# EAGLE schematic pdp8 (EAGLE 6.6.0)
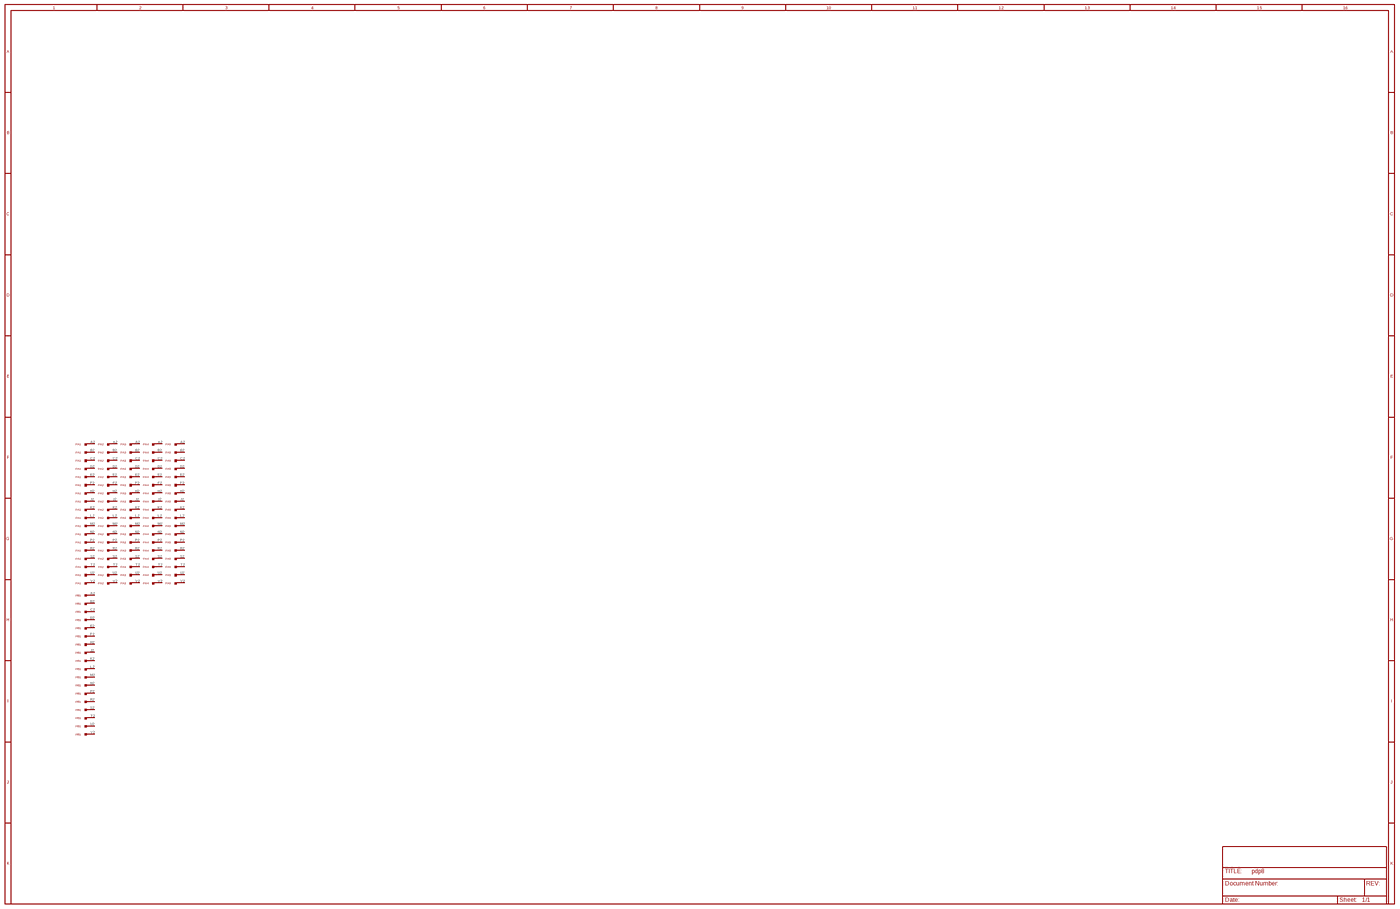
[diagram p0: schematic, sheet 1, overview]
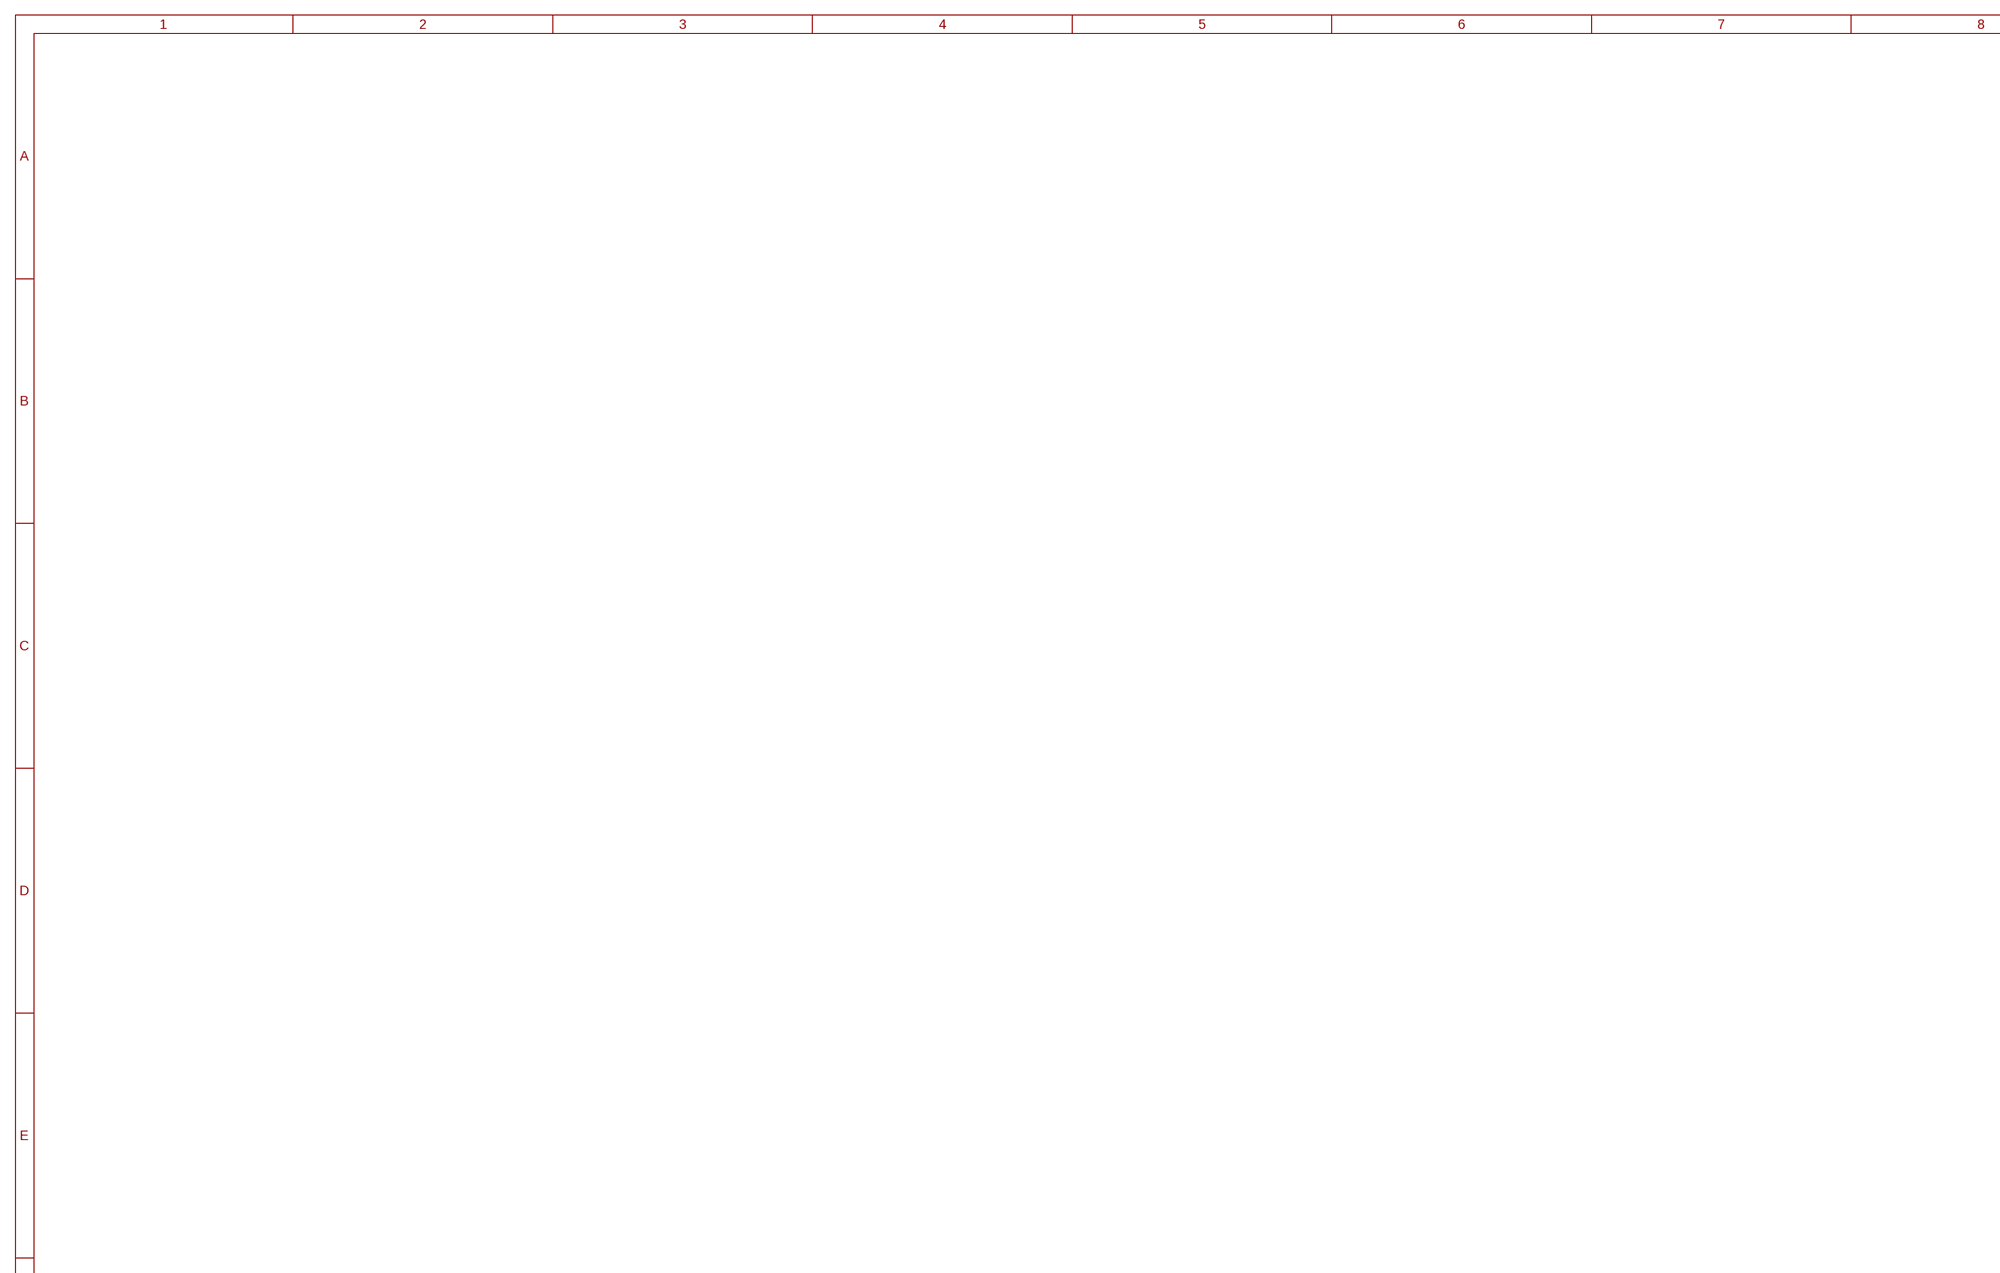
[diagram p1: schematic, sheet 1, part 1 of 4]
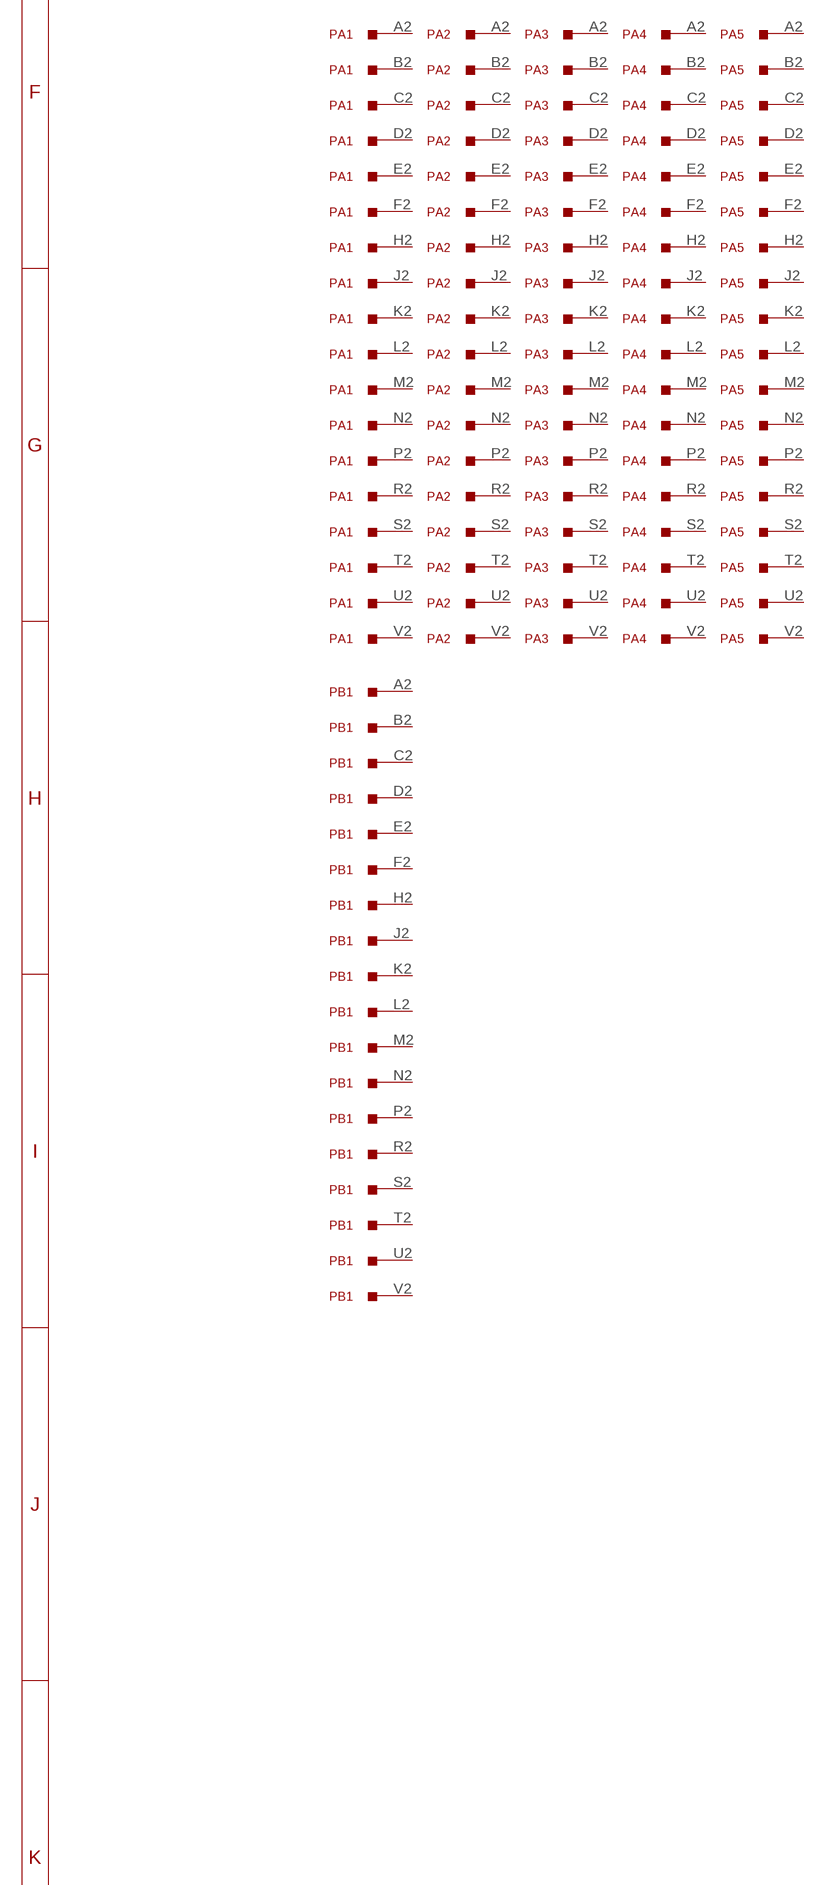
[diagram p2: schematic, sheet 1, part 2 of 4]
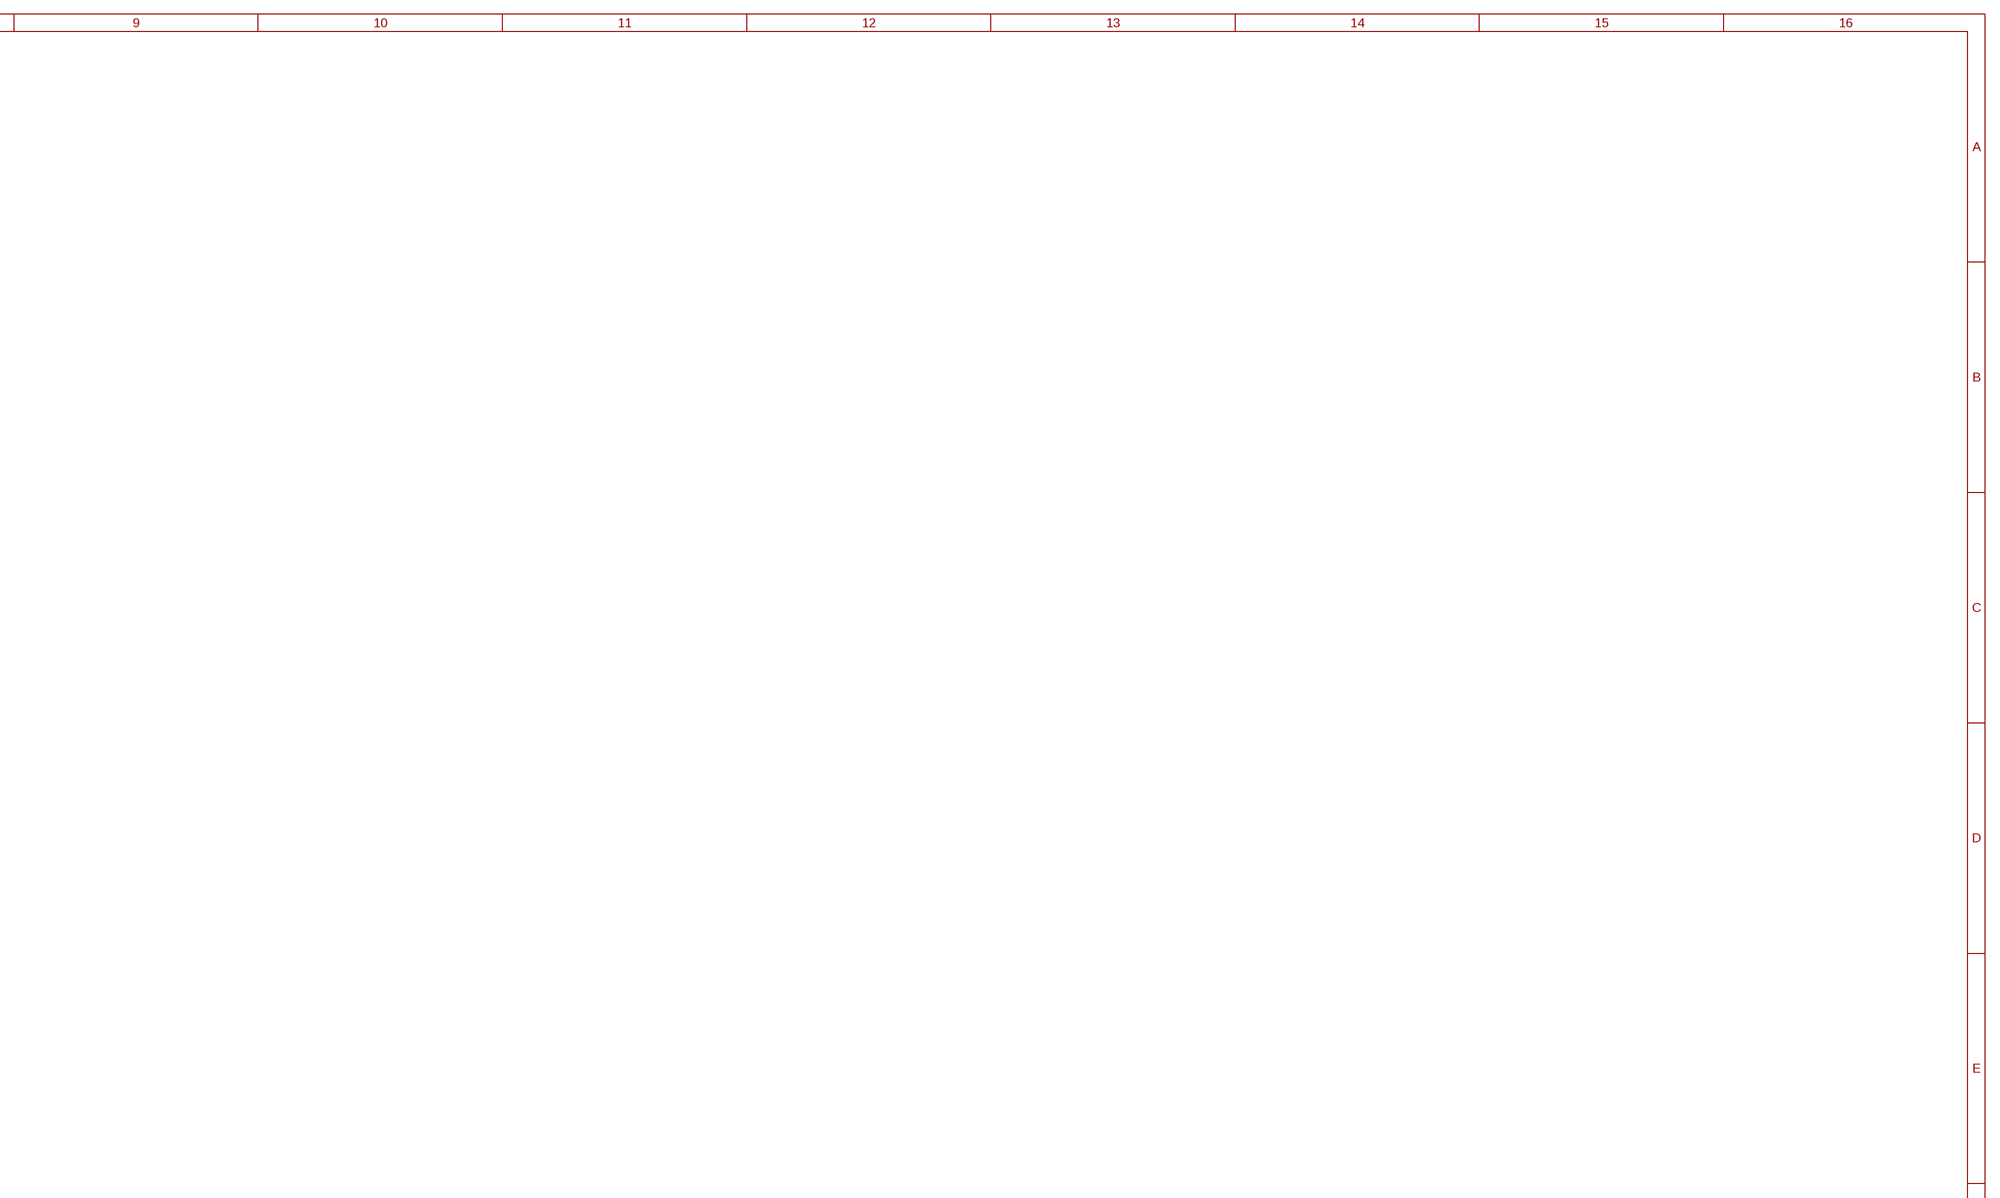
[diagram p3: schematic, sheet 1, part 3 of 4]
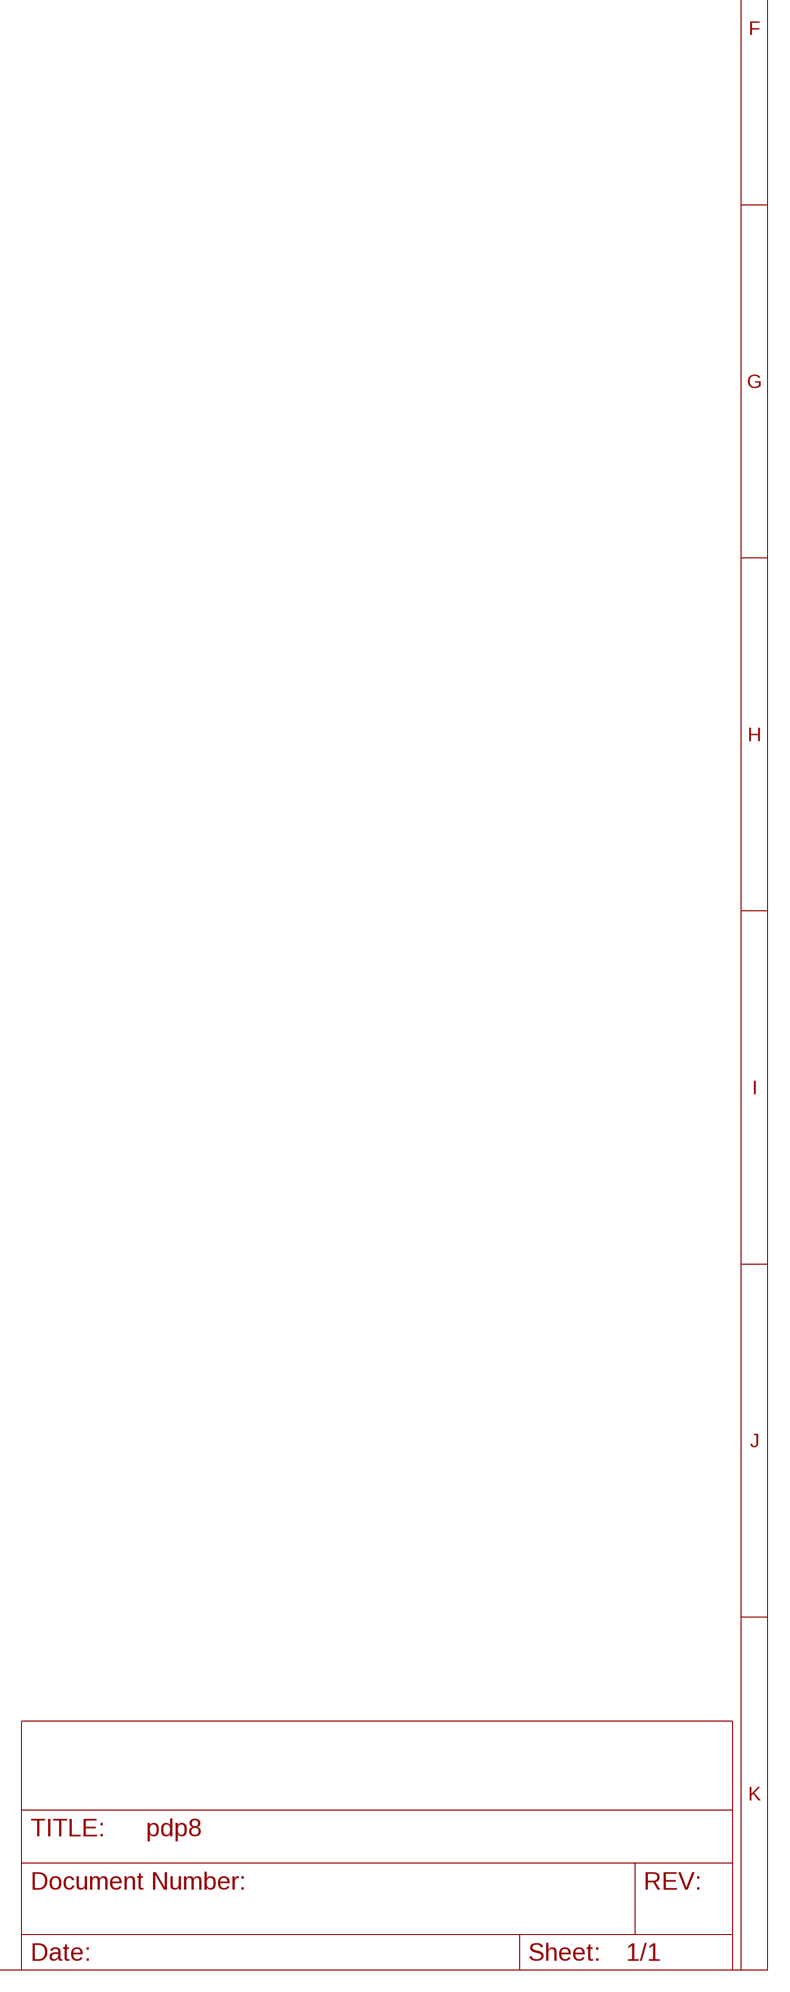
[diagram p4: schematic, sheet 1, part 4 of 4]

## Parts
PA1  W024  W023O  [H800]
PA2  W026  W023O  [H800]
PA3  W020  W023O  [H800]
PA4  W026  W023O  [H800]
PA5  W026  W023O  [H800]
PB1  W024  W023O  [H800]
Unconnected: PA1.A2 PA1.B2 PA1.C2 PA1.D2 PA1.E2 PA1.F2 PA1.H2 PA1.J2 PA1.K2 PA1.L2 PA1.M2 PA1.N2 PA1.P2 PA1.R2 PA1.S2 PA1.T2 PA1.U2 PA1.V2 PA2.A2 PA2.B2 PA2.C2 PA2.D2 PA2.E2 PA2.F2 PA2.H2 PA2.J2 PA2.K2 PA2.L2 PA2.M2 PA2.N2 PA2.P2 PA2.R2 PA2.S2 PA2.T2 PA2.U2 PA2.V2 PA3.A2 PA3.B2 PA3.C2 PA3.D2 PA3.E2 PA3.F2 PA3.H2 PA3.J2 PA3.K2 PA3.L2 PA3.M2 PA3.N2 PA3.P2 PA3.R2 PA3.S2 PA3.T2 PA3.U2 PA3.V2 PA4.A2 PA4.B2 PA4.C2 PA4.D2 PA4.E2 PA4.F2 PA4.H2 PA4.J2 PA4.K2 PA4.L2 PA4.M2 PA4.N2 PA4.P2 PA4.R2 PA4.S2 PA4.T2 PA4.U2 PA4.V2 PA5.A2 PA5.B2 PA5.C2 PA5.D2 PA5.E2 PA5.F2 PA5.H2 PA5.J2 PA5.K2 PA5.L2 PA5.M2 PA5.N2 PA5.P2 PA5.R2 PA5.S2 PA5.T2 PA5.U2 PA5.V2 PB1.A2 PB1.B2 PB1.C2 PB1.D2 PB1.E2 PB1.F2 PB1.H2 PB1.J2 PB1.K2 PB1.L2 PB1.M2 PB1.N2 PB1.P2 PB1.R2 PB1.S2 PB1.T2 PB1.U2 PB1.V2

## Library data of the parts
PA1-PA5 PB1 = dec-m:W023: One-sided 18 pin connector/cable.